# Altium schematic sheet ShieldBoard.SchDoc
size A; SheetNumber: 1; SheetTotal: 1
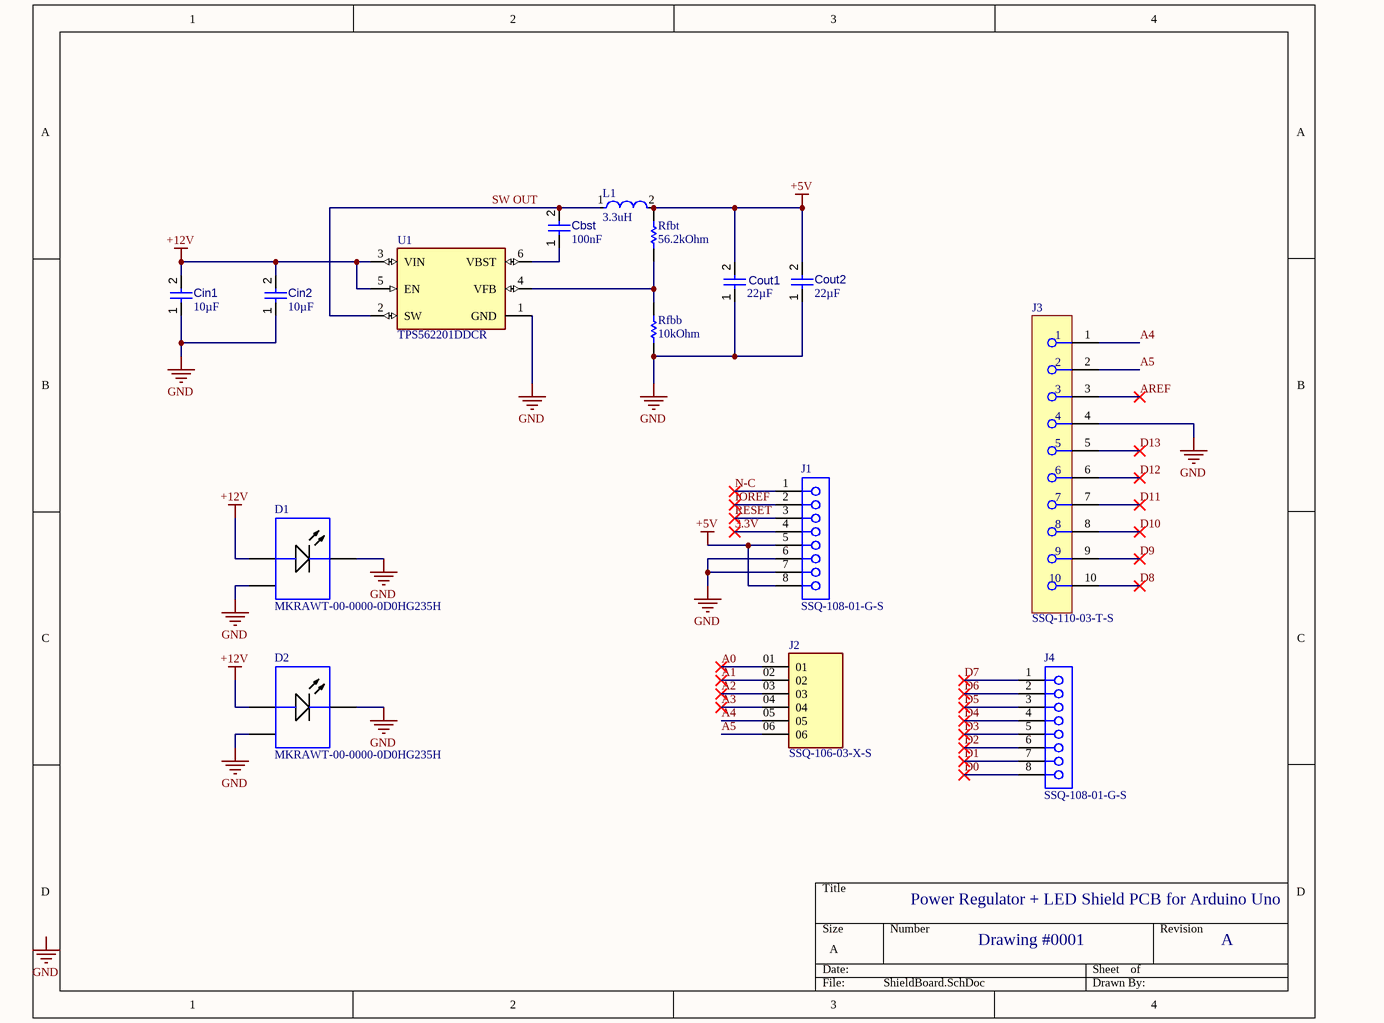
[diagram p0: ShieldBoard.SchDoc]

## Parts
Cbst  value 100nF  [CAPC0402(1005)60_L]  (hidden comment: Capacitor 100nF +/-20% 50V 0402)
Cin1  value 10µF  [CAPC0805(2012)145_L]  (hidden comment: Capacitor 10µF +/-20% 25V 0805)
Cin2  value 10µF  [CAPC0805(2012)145_L]  (hidden comment: Capacitor 10µF +/-20% 25V 0805)
Cout1  value 22µF  [CAPC0805(2012)145_L]  (hidden comment: Capacitor 22µF +/-40% 16V 0805)
Cout2  value 22µF  [CAPC0805(2012)145_L]  (hidden comment: Capacitor 22µF +/-40% 16V 0805)
D1  MKRAWT-00-0000-0D0HG235H  [CREE-MK-R-2_V]
D2  MKRAWT-00-0000-0D0HG235H  [CREE-MK-R-2_V]
J1  SSQ-108-01-G-S  [SMTC-SSQ-108-01-X-S]
J2  SSQ-106-03-X-S  [SAMTEC_SSQ-106-03-X-S]
J3  SSQ-110-03-T-S  [FP-SSQ-110-03-T-S-MFG]
J4  SSQ-108-01-G-S  [SMTC-SSQ-108-01-X-S]
L1  3.3uH  [FP-NRS8030-MFG]
Rfbb  10kOhm  [RESC1005X40X25LL05T05]
Rfbt  56.2kOhm  [RESC0603X28X15NL05T05]
U1  TPS562201DDCR  [FP-DDC0006A-IPC_C]

## Nets
+5V: Cout1.2 Cout2.2 J1.5 J1.8 L1.2 Rfbt.2
+12V: Cin1.2 Cin2.2 D1.1(A) D2.1(A) U1.3(VIN) U1.5(EN)
GND: Cin1.1 Cin2.1 Cout1.1 Cout2.1 D1.2(K) D1.3(EP) D2.2(K) D2.3(EP) J1.6 J1.7 J3.4 Rfbb.1 U1.1(GND)
3.3V: J1.4
A0: J2.01
A1: J2.02
A2: J2.03
A3: J2.04
A4: J2.05 J3.1
A5: J2.06 J3.2
AREF: J3.3
D0: J4.8
D1: J4.7
D2: J4.6
D3: J4.5
D4: J4.4
D5: J4.3
D6: J4.2
D7: J4.1
D8: J3.10
D9: J3.9
D10: J3.8
D11: J3.7
D12: J3.6
D13: J3.5
IOREF: J1.2
N-C: J1.1
RESET: J1.3
SW OUT: Cbst.2 L1.1 U1.2(SW)
NetCbst_1: Cbst.1 U1.6(VBST)
NetRfbb_2: Rfbb.2 Rfbt.1 U1.4(VFB)

## Notes on the sheet
- Power Regulator + LED Shield PCB for Arduino Uno
- Drawing #0001
- A
- Labels drawn without touching a wire or pin: GND

## Library data of the parts
Cbst = CMP-001-00067-3: Chip Capacitor, 100nF +/-20%, 50V, 0402, Thickness 0.6 mm; Tolerance: 10%; Min Operating Temperature: -55°C; Pins: 2; Case/Package: 0402; Max Operating Temperature: 85°C; Voltage Rating: 50V; Mounting Technology: SMT
Cin1 Cin2 = CMP-001-00079-4: Chip Capacitor, 10µF +/-20%, 25V, 0805, Thickness 1.45 mm; Tolerance: 10%; Max Operating Temperature: 85°C; Case/Package: 0805; Voltage Rating: 25V; Min Operating Temperature: -55°C; Mounting Technology: SMT; Pins: 2
Cout1 Cout2 = CMP-001-00081-4: Chip Capacitor, 22µF +/-40%, 16V, 0805, Thickness 1.45 mm; Tolerance: 5%; Voltage Rating: 16V; Mounting Technology: SMT; Pins: 2; Max Operating Temperature: 85°C; Case/Package: 0805; Min Operating Temperature: -55°C
D1 D2 = CMP-2100-00977-1: LED, White, 12 V, 2-Pin SMD, RoHS, Tape and Reel
J1 J4 = CMP-1023-00292-1: SQ Post Socket, Through-hole, Vertical, -55 to 125 degC, 2.54 mm Pitch, 8-Pin, Female, RoHS; Manufacturer: Samtec; Pitch: 2.54 mm; ComponentLink3URL: http://www.samtec.com/documents/webfiles/cpdf/SSQ-1XX-XX-XXX-X-XX-XXX-XX-X-MKT.pdf; ComponentLink3Description: Package Specification; RoHS: True; ComponentLink1URL: http://www.samtec.com; Mounting Technology: Through-hole; PackageVersion: BD, 6/1987; ComponentLink1Description: Manufacturer URL; PartNumber: SSQ-108-01-G-S; ComponentLink2Description: Datasheet; Temperature Range: -55 to 125 degC; ComponentLink2URL: http://www.samtec.com/documents/webfiles/pdf/SSQ_TH.PDF; PackageDescription: Assembly, Socket Strip .025[0.64] SQ Tail; PackageReference: SSQ-108-01-X-S; Orientation: Vertical; DatasheetVersion: F-214
J2 = SSQ-106-03-X-S: SSQ - Samtec 2.54mm Square Tail Single Row Socket Strip 8.5mm Profile - Fast Stock; MF: Samtec Inc.; MP: SSQ-106-03-T-S; SnapEDA_Link: https://www.snapeda.com/parts/SSQ-106-03-T-S/Samtec+Inc./view-part/?ref=snap; Package: None; Value: *; Check_prices: https://www.snapeda.com/parts/SSQ-106-03-T-S/Samtec+Inc./view-part/?ref=eda
J3 = CMP-00575-00295916-2: SSQ-110-03-T-S Headers & Wire Housings Tiger Buy Socket Strip with Square Tails, 0.100 Pitch; Manufacturer Lifecycle Status: PRODUCTION; Voltage Rating (DC): 655V; Number of Contacts: 10; Pitch: 2.54mm; Connector Type: Receptacle, Socket; Current Rating: 6.3A; Voltage Rating (AC): 465V; Min Operating Temperature: -55°C; Lifecycle Status: Production; Contact Material: Nickel, Tin; Radiation Hardening: No; Max Operating Temperature: 105°C; Termination: Solder; Width: 2.41mm; Housing Color: Black; Height: 8.64mm; Number of Rows: 1; Packaging: Bulk; Mount: Through Hole; Lead Free: Lead Free; Number of Pins: 10; Color: Black; Voltage Rating: 655V; Contact Plating: Tin; Housing Material: Plastic; Number of Positions: 10; RoHS: Compliant; Length: 25.9mm
L1 = CMP-14484-000405-1: Inductor Power Shielded Wirewound 3.3uH 20% 100KHz Ferrite 4.2A 24.7mΩ DCR T/R; Current Rating: 4.3A; DC Resistance (DCR): 19mR; Self Resonant Frequency: 50MHz; Height: 3mm; Lead Free: Lead Free; Saturation Current: 4.2A; Termination: SMD/SMT; RoHS Compliant: Yes; Resistor Type: Wirewound; RMS Current (Irms): 4.3A; Series: NRS; Halogen Free: Halogen Free; Shielding: Shielded; Length: 8mm; Max DC Current: 4.2A; Height - Seated (Max): 0.118inch; Radiation Hardening: No; Min Operating Temperature: -25°C; Number of Pins: 2; Core Material: Ferrite; Inductance: 3.3uH; Package Quantity: 1000; REACH SVHC: No SVHC; Test Frequency: 100kHz; Tolerance: 20%; Case/Package: Nonstandard; Inductance Tolerance: 20%; Width: 0.315inch; Mount: Surface Mount; Depth: 8.2mm; Lead Pitch: 5.6mm; Packaging: Tape and Reel; Max Operating Temperature: 125°C
Rfbb = CMP-2000-07588-1: Chip Resistor, 10 KOhm, +/- 1%, 0.1 W, -55 to 155 degC, 0402 (1005 Metric), RoHS, Tape and Reel; Manufacturer: Panasonic; Power Rating: 100mW; Voltage Rating: 50V; Case\/Package: 0402; Temperature Coefficient: 100ppm\/degreesC; RoHSCompliant: True; Lead Free: LeadFree; Package Quantity: 1; Contact Plating: Tin; Resistance: 10KOhm; Length: 1mm; Radiation Hardening: No; REACH SVHC: NoSVHC; Max Operating Temperature: 155degC; Depth: 0.5mm; Case Code (Imperial): 0402; Military Standard: Not; Package Description: 2-Pin Surface Mount Device, Body 1 x 0.5 mm; Termination: SMD/SMT; Case Code (Metric): 1005; Height: 0.35mm; Packaging: TapeandReel; Voltage Rating (DC): 50V; Package Reference: 402; Number of Pins: 2; Tolerance: 1%; Mounting Technology: SurfaceMount; Width: 0.02inch; Mount: SurfaceMount; Datasheet URL: https://industrial.panasonic.com/cdbs/www-data/pdf/RDA0000/AOA0000C304.pdf; Composition: ThickFilm; Datasheet Version: 02/2017; Manufacturer URL: http://www.panasonic.com/; Max Power Dissipation: 100mW; Number of Terminations: 2; Min Operating Temperature: -55degC
Rfbt = CMP-2004-00723-1: Manufacturer: Vishay Dale; Part Number: CRCW020156K2FNED
U1 = CMP-04918-000361-1: IC REG BUCK ADJ 2A TSOT23-6; Switching Frequency: 580kHz; Max Input Voltage: 17V; Number of Outputs: 1; Output Voltage: 7V; Output Type: Adjustable; Quiescent Current: 400uA; Min Input Voltage: 4.5V; Mount: Surface Mount; Max Operating Temperature: 125°C; Lead Free: Lead Free; Operating Supply Voltage: 17V; Number of Pins: 6; RoHS Compliant: Yes; Contact Plating: Tin; Min Operating Temperature: -40°C; Case/Package: SOT; Max Output Current: 2A